# EasyEDA Pro project 智能视觉调参板.eprj

# Schematic 原理图
Create Date: 2023-11-29; Page Name: P1; Project Name: 智能视觉调参板; Schematic Name: Schematic1; Update Date: 2023-11-29; Company: 嘉立创EDA; Page Size: A4; Version: V1.0
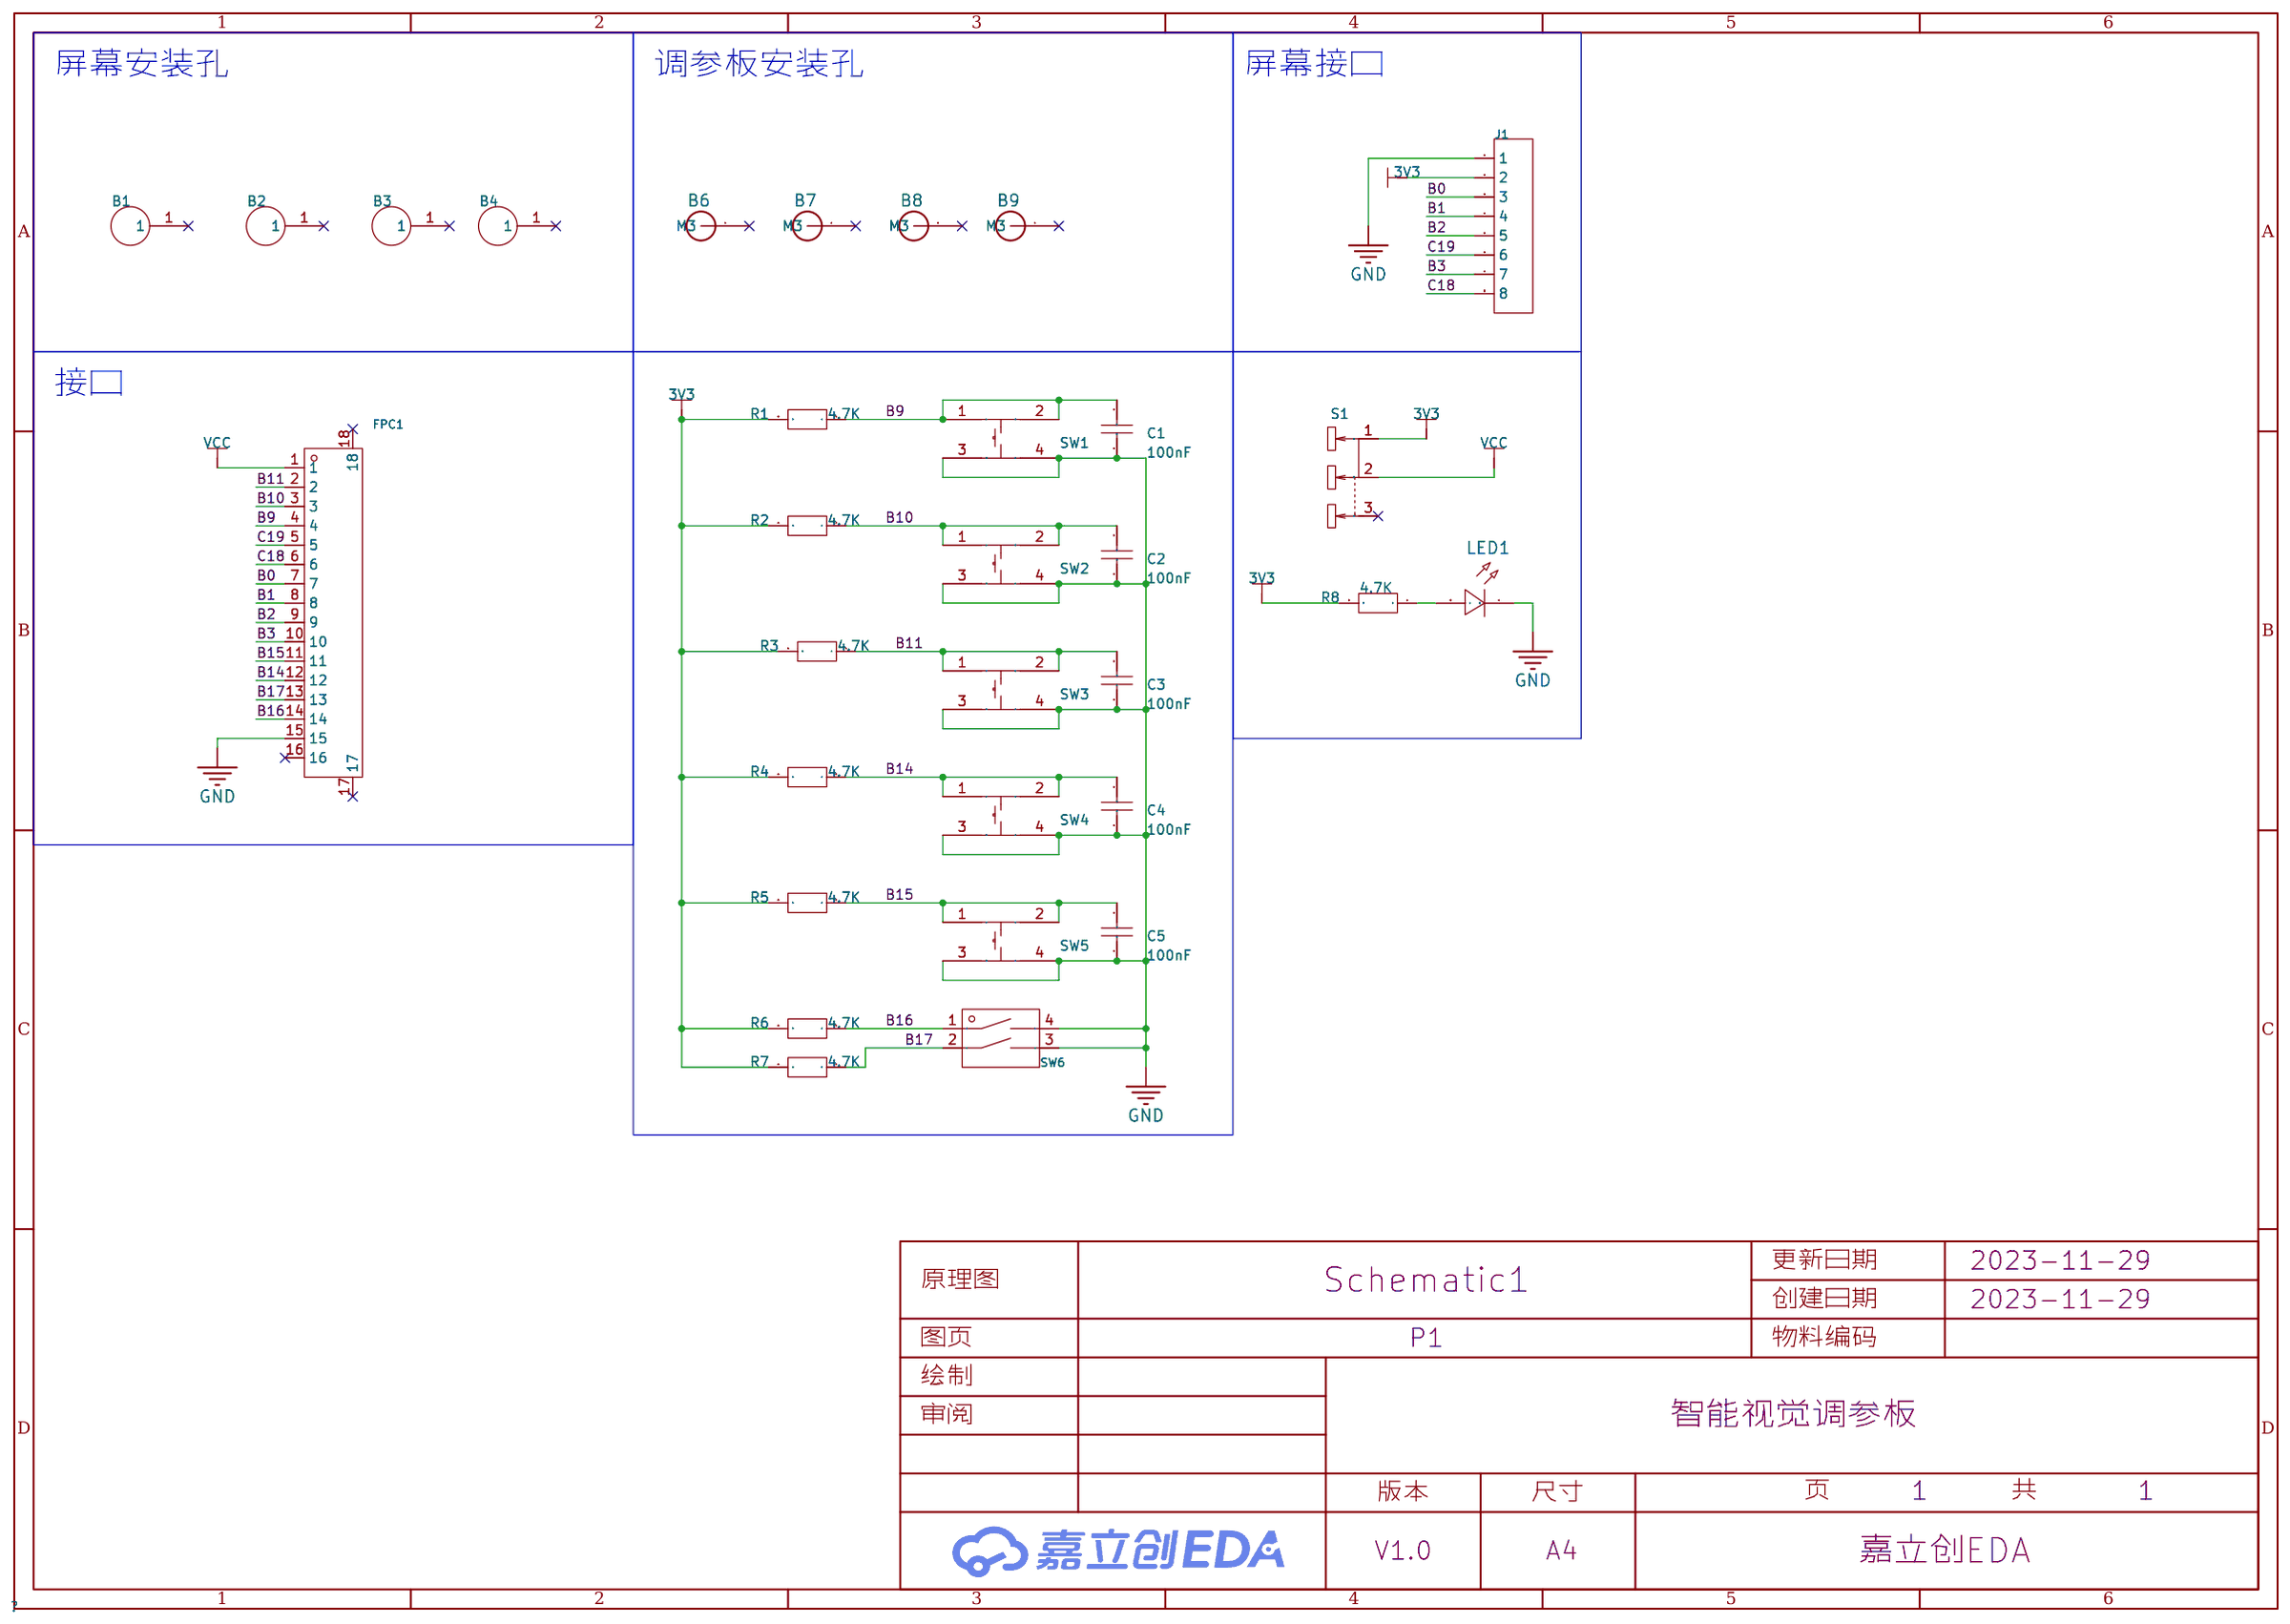
[diagram p0: schematic sheet]

## Parts
B1  -  [M2]
B2  -  [M2]
B3  -  [M2]
B4  -  [M2]
B6  M3螺柱孔_JX  [M3]
B7  M3螺柱孔_JX  [M3]
B8  M3螺柱孔_JX  [M3]
B9  M3螺柱孔_JX  [M3]
C1  100nF  [C0603]
C2  100nF  [C0603]
C3  100nF  [C0603]
C4  100nF  [C0603]
C5  100nF  [C0603]
FPC1  FPC-05F-16PH20  [FPC-SMD_16P-P0.50_FPC-05F-16PH20]
J1  -  [HDR-TH_8P-P2.54-V-F-1]
LED1  -  [LED_0603]
R1  4.7K  [R0603]
R2  4.7K  [R0603]
R3  4.7K  [R0603]
R4  4.7K  [R0603]
R5  4.7K  [R0603]
R6  4.7K  [R0603]
R7  4.7K  [R0603]
R8  4.7K  [R0603]
S1  SS-12D10L3  [SW-TH_SS-12D10L3]
SW1  TS-1002S-05026C  [KEY-SMD_4P-L6.0-W6.0-P4.50-LS9.0]
SW2  TS-1002S-05026C  [KEY-SMD_4P-L6.0-W6.0-P4.50-LS9.0]
SW3  TS-1002S-05026C  [KEY-SMD_4P-L6.0-W6.0-P4.50-LS9.0]
SW4  TS-1002S-05026C  [KEY-SMD_4P-L6.0-W6.0-P4.50-LS9.0]
SW5  TS-1002S-05026C  [KEY-SMD_4P-L6.0-W6.0-P4.50-LS9.0]
SW6  KF1001-02P-R0-FL-ON-01B  [SW-TH_KF1001-02P-R0-FL-ON-01B]

## Library data of the parts
B1-B4 = M2
B6-B9 = M3螺柱孔_JX
C1-C5 = 0603B104K500NT: 容值:100nF;精度:±10%;额定电压:50V;材质(温度系数):X7R;; LCSC Part Name: 100nF ±10% 50V; Supplier Part: C30926; Manufacturer: FH(风华); Supplier Footprint: 0603; JLCPCB Part Class: Extended Part; Datasheet: https://atta.szlcsc.com/upload/public/pdf/source/20200305/C486355_26A10D38EF8C2A5C37091D0039909270.pdf; Supplier: LCSC; Tolerance: ±10%; Voltage Rated: 50V; Temperature Coefficient: X7R
FPC1 = FPC-05F-16PH20: 间距:0.5mm;触点数量:16P;锁定特性:翻盖式;安装类型:卧贴;触点类型:下接;工作温度范围:-25℃~+85℃;; LCSC Part Name: 0.5mm P数:16P 翻盖式 下接; Supplier Part: C2856801; Manufacturer: XUNPU(讯普); Supplier Footprint: SMD,P=0.5mm; JLCPCB Part Class: Extended Part; Datasheet: https://atta.szlcsc.com/upload/public/pdf/source/20210922/C2856801_73A554E58C5577257FCEC843978D3BA6.pdf; Supplier: LCSC; Pitch: 0.5mm; Number of Contacts: 16P; Locking Feature: 翻盖式; Mounting Type: 卧贴; Contact Type: 下接; Height Above Board: 2mm; FFC, FCB Thickness: 0.3mm; Operating Temperature Range: -25℃~+85℃
J1 = HDR-F_2.54_1x8P: Supplier Part: C27438; Supplier Footprint: 插件
LED1 = LED_0603-R: Supplier Footprint: 0603
R1-R8 = 0603: Supplier Part: C9900021181; JLCPCB Part Class: 扩展库; Datasheet: https://atta.szlcsc.comnull; Supplier: LCSC
S1 = SS-12D10L3: 额定电流(DC):3A;额定电压(DC):125V;额定电流(AC):3A;额定电压(AC):125V;电路结构:单刀双掷;安装方式:直插;机械寿命:1万次;开关颜色:黑色;; LCSC Part Name: 柄长3mm 直插双档 滑动开关 大电流; Supplier Part: C319013; Manufacturer: XKB Connectivity(中国星坤); Supplier Footprint: 插件; JLCPCB Part Class: 扩展库; Datasheet: https://atta.szlcsc.com/upload/public/pdf/source/20211009/D6412F37AABE6F9459A6EE7FA4DAEADB.pdf; Supplier: LCSC; Current Rating (DC): 3A; Voltage Rating (DC): 125V; Current Rating (AC): 3A; Voltage Rating (AC): 125V; Circuit: 单刀双掷; Mounting Style: 直插; Mechanical Life: 1万次; Actuator Color: 黑色; Actuator Style: 矩形柱状; Pin Style: PC引脚; Operating Temperature: -40℃~+85℃; Switch Length: 13mm; Switch Width: 6.8mm; Switch Height: 6.4mm
SW1-SW5 = TS-1002S-05026C: 电路结构:单刀单掷;触点电流:50mA;额定电压(DC):12V;安装方式:立贴;带灯:-;机械寿命:-;; LCSC Part Name: 6*6*5mm 立贴 轻触开关; Supplier Part: C455110; Manufacturer: XUNPU(讯普); Supplier Footprint: SMD,6x6mm; JLCPCB Part Class: 扩展库; Datasheet: https://atta.szlcsc.com/upload/public/pdf/source/20191118/C455126_F61E8FA1ED640FB1CE0B30B55DEB62E3.pdf; Supplier: LCSC; Circuit: 单刀单掷; Actuator Style: 圆形按钮; Switch Length: 6mm; Switch Width: 6mm; Switch Height: 5mm; Contact Current: 50mA; Voltage Rating (DC): 12V; Mounting Style: 立贴
SW6 = KF1001-02P-R0-FL-ON-01B: 拨码开关 平拨，凸起式 单刀单掷  2  2.54mm; LCSC Part Name: 间距2.54mm 平拨,凸起式 2位拨码开关; Supplier Part: C976324; Manufacturer: 凯峰; Supplier Footprint: 插件; JLCPCB Part Class: Extended Part; Datasheet: https://atta.szlcsc.com/upload/public/pdf/source/20201229/C976324_7B1CB18A800AB7399198E0C73F3ACFC5.pdf; Supplier: LCSC

## Nets
3V3: J1.2 R1.2 R2.2 R3.2 R4.2 R5.2 R6.2 R7.2 R8.2 S1.1
GND: C1.1 C2.1 C3.1 C4.1 C5.1 FPC1.15 J1.1 LED1.1(C) SW1.3 SW1.4 SW2.3 SW2.4 SW3.3 SW3.4 SW4.3 SW4.4 SW5.3 SW5.4 SW6.3 SW6.4
VCC: FPC1.1 S1.2
B0: FPC1.7 J1.3
B1: FPC1.8 J1.4
B2: FPC1.9 J1.5
B3: FPC1.10 J1.7
B9: C1.2 FPC1.4 R1.1 SW1.1 SW1.2
B10: C2.2 FPC1.3 R2.1 SW2.1 SW2.2
B11: C3.2 FPC1.2 R3.1 SW3.1 SW3.2
B14: C4.2 FPC1.12 R4.1 SW4.1 SW4.2
B15: C5.2 FPC1.11 R5.1 SW5.1 SW5.2
B16: FPC1.14 R6.1 SW6.1
B17: FPC1.13 R7.1 SW6.2
C18: FPC1.6 J1.8
C19: FPC1.5 J1.6
Net-(LED1-2): LED1.2(A) R8.1

Not connected (* = marked no-connect by the designer): B1 1*; B2 1*; B3 1*; B4 1*; B6 1(M3)*; B7 1(M3)*; B8 1(M3)*; B9 1(M3)*; FPC1 16* 17* 18*; S1 3*

## Notes on the sheet
- 屏幕安装孔
- 调参板安装孔
- 屏幕接口
- 接口

# Board 调参板_V1
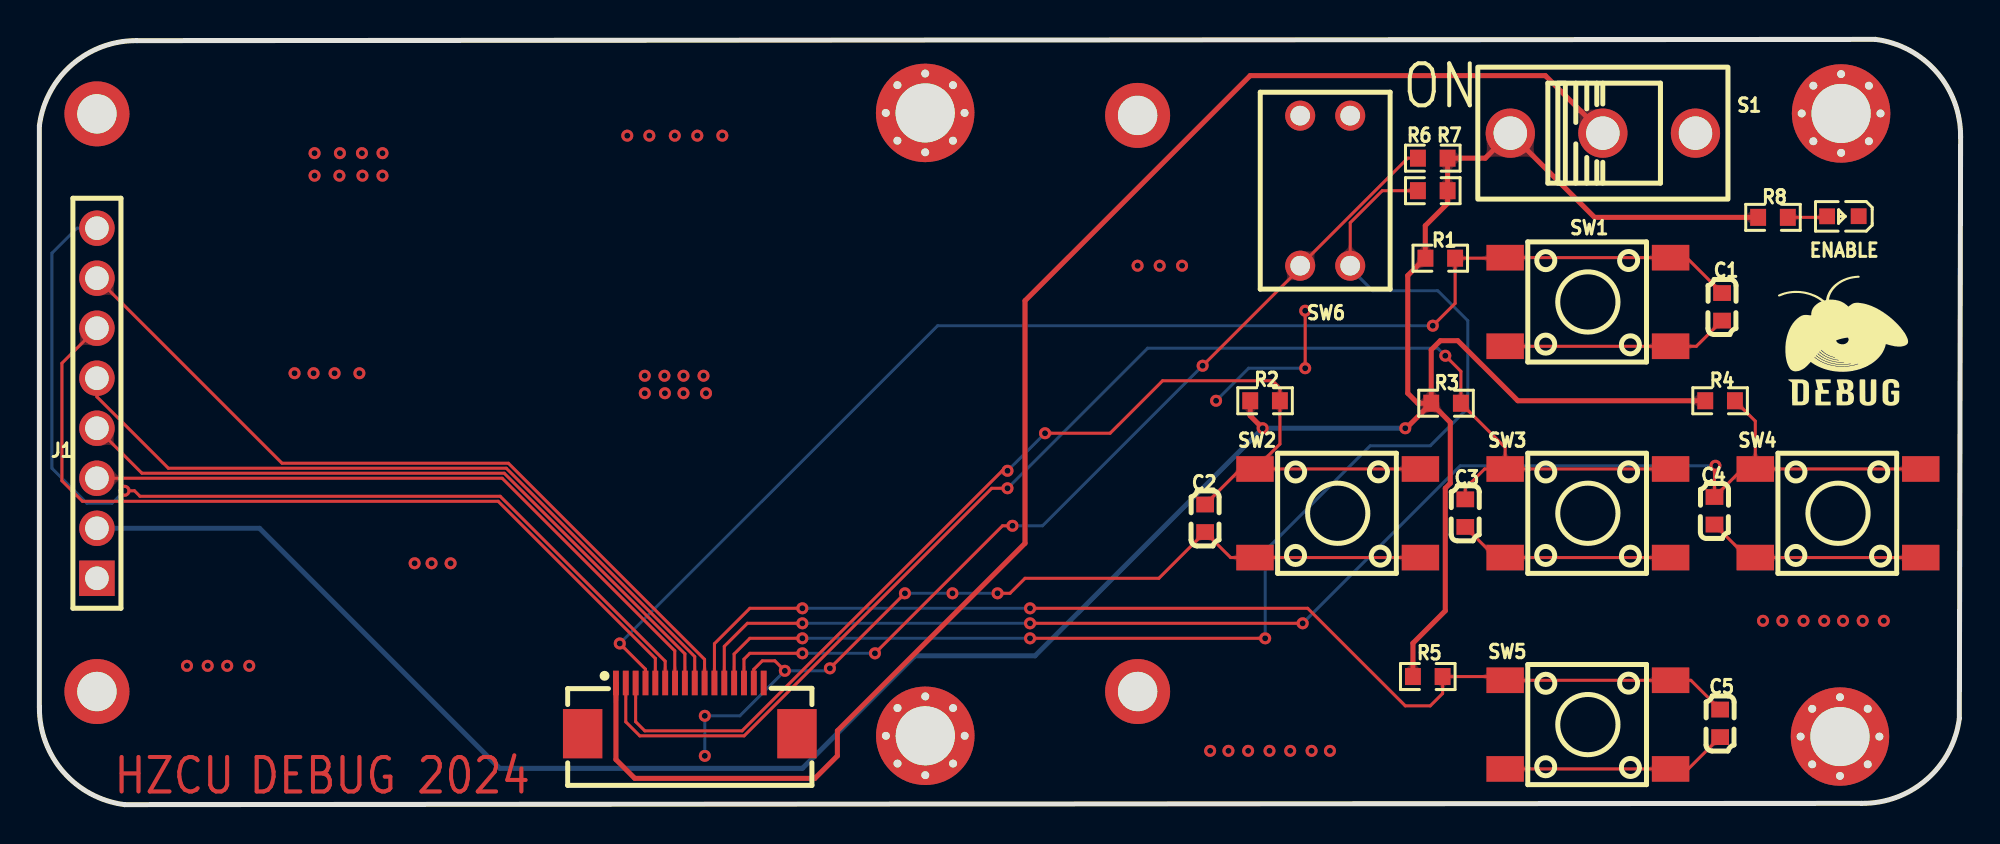
[diagram p1: board, top side]
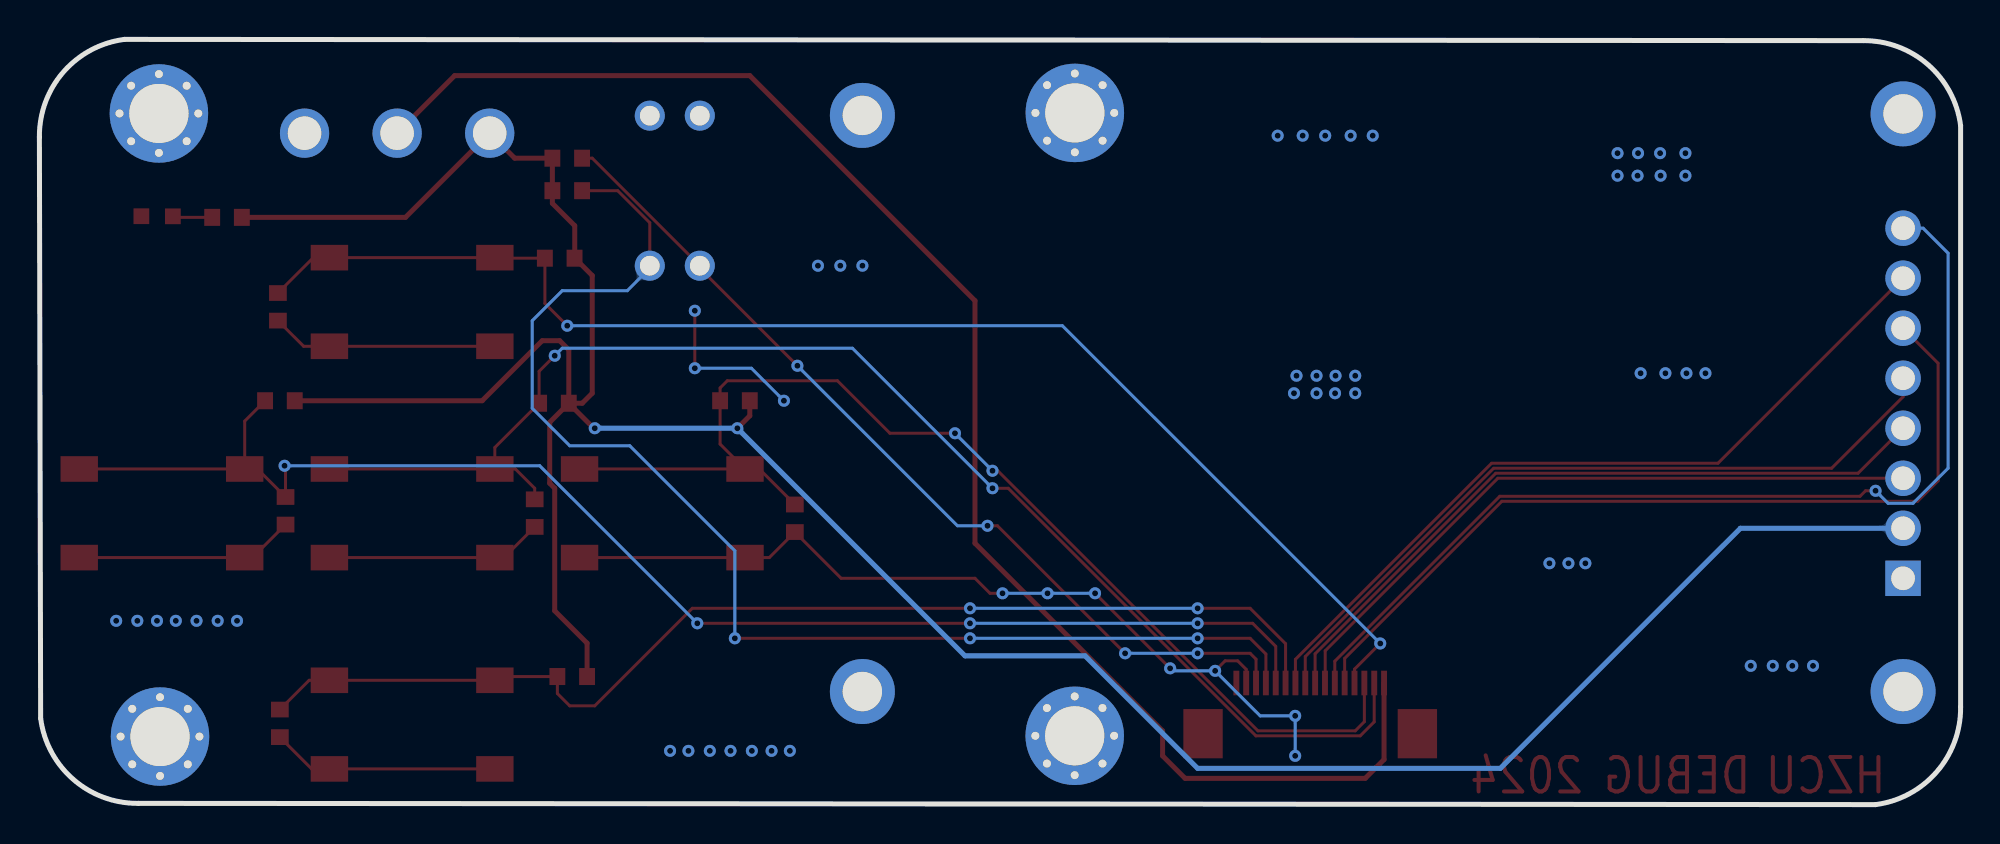
[diagram p2: board, bottom side, seen from below]

Outline 97.54 x 38.86 mm; copper layers: Top Layer, Bottom Layer. Coordinates in mm from the lower left corner of the outline.
Outline path: 0,34.48 0,4.95 arc(1.22,1.66) 4.32,0 92.52,0.06 arc(95.82,1.28) 97.47,4.38 97.54,33.91 arc(96.32,37.21) 93.22,38.86 4.95,38.8 arc(1.66,37.58) 0,34.48
Stack: Top Layer 0.035mm / Dielectric1 1.51mm FR4 er 4.5 / Bottom Layer 0.035mm

## Design rules (mm)
template: JLCPCB Capability(Two Layers Board)
spacing copperThickness1oz (default): track to track 0.102, other pairs 0.152 to 0.3
spacing copperThickness2oz: track to track 0.203, other pairs 0.152 to 0.3
track width copperThickness1oz (default): min 0.127, default 0.254, max 2.54
track width copperThickness2oz: min 0.203, default 0.254, max 2.54
differential pair differentialPair (default): width min 0.127, default 0.254, max 2.54; gap min 0.152, default 0.152
via viaSize (default): diameter min 0.5, default 0.61, max 10; hole min 0.3, default 0.305, max 6.3

## Placement (name value [footprint] x y rotation side)
B1  -  [M2]  55.76 35 0 top
B2  -  [M2]  2.92 5.74 0 top
B3  -  [M2]  2.92 35.08 0 top
B4  -  [M2]  55.76 5.74 0 top
B6  M3螺柱孔_JX  [M3]  91.41 3.46 0 top
B7  M3螺柱孔_JX  [M3]  44.98 3.5 0 top
B8  M3螺柱孔_JX  [M3]  91.47 35.1 0 top
B9  M3螺柱孔_JX  [M3]  44.97 35.13 0 top
C1  100nF  [C0603]  85.43 25.28 90 top
C2  100nF  [C0603]  59.18 14.54 90 top
C3  100nF  [C0603]  72.39 14.8 90 top
C4  100nF  [C0603]  85.04 14.92 90 top
C5  100nF  [C0603]  85.33 4.13 90 top
ENABLE  -  [LED_0603]  91.51 29.87 180 top
FPC1  FPC-05F-16PH20  [FPC-SMD_16P-P0.50_FPC-05F-16PH20]  33.02 4.89 0 top
J1  -  [HDR-TH_8P-P2.54-V-F-1]  2.92 20.38 90 top
R1  4.7K  [R0603]  71.12 27.75 180 top
R2  4.7K  [R0603]  62.22 20.51 180 top
R3  4.7K  [R0603]  71.41 20.38 180 top
R4  4.7K  [R0603]  85.33 20.51 180 top
R5  4.7K  [R0603]  70.48 6.5 180 top
R6  4.7K  [R0603]  70.74 32.83 0 top
R7  4.7K  [R0603]  70.74 31.18 0 top
R8  4.7K  [R0603]  88.01 29.82 180 top
S1  SS-12D10L3  [SW-TH_SS-12D10L3]  79.38 34.1 0 top
SW1  TS-1002S-05026C  [KEY-SMD_4P-L6.0-W6.0-P4.50-LS9.0]  78.61 25.53 0 top
SW2  TS-1002S-05026C  [KEY-SMD_4P-L6.0-W6.0-P4.50-LS9.0]  65.91 14.8 0 top
SW3  TS-1002S-05026C  [KEY-SMD_4P-L6.0-W6.0-P4.50-LS9.0]  78.61 14.8 0 top
SW4  TS-1002S-05026C  [KEY-SMD_4P-L6.0-W6.0-P4.50-LS9.0]  91.31 14.8 0 top
SW5  TS-1002S-05026C  [KEY-SMD_4P-L6.0-W6.0-P4.50-LS9.0]  78.61 4.06 0 top
SW6  KF1001-02P-R0-FL-ON-01B  [SW-TH_KF1001-02P-R0-FL-ON-01B]  65.28 31.18 0 top

## Footprints (pads in the part's own frame, mm; a bottom-side part is the same pattern mirrored in y, then rotated)
C0603
  rect 0.8x0.9 smd: 1(-0.7,0) 2(0.7,0)
FPC-SMD_16P-P0.50_FPC-05F-16PH20
  rect 0.3x1.25 smd: 1(-3.75,1.288) 2(-3.25,1.288) 3(-2.75,1.288) 4(-2.25,1.288) 5(-1.75,1.288) 6(-1.25,1.288) 7(-0.75,1.288) 8(-0.25,1.288) 9(0.25,1.288) 10(0.75,1.288) 11(1.25,1.288) 12(1.75,1.288) 13(2.25,1.288) 14(2.75,1.288) 15(3.25,1.288) 16(3.75,1.288)
  rect 2x2.5 smd: 17(5.44,-1.288) 18(-5.44,-1.288)
HDR-TH_8P-P2.54-V-F-1
  rect 1.8x1.8 hole 1.2: 1(-8.89,0)
  round 1.8 hole 1.2: 2(-6.35,0) 3(-3.81,0) 4(-1.27,0) 5(1.27,0) 6(3.81,0) 7(6.35,0) 8(8.89,0)
KEY-SMD_4P-L6.0-W6.0-P4.50-LS9.0
  rect 1.9x1.3 smd: 1(-4.2,2.25) 2(4.2,2.25) 3(-4.2,-2.25) 4(4.2,-2.25)
LED_0603
  rect 0.8x0.8 smd: 1(-0.851,-0.01) 2(0.75,-0.005)
M2
  round 3.3 hole 2: 1(0,0)
M3
  round 0.6 hole 0.405x0.4: 1(-2,0) 1(-1.41,1.409) 1(-1.41,-1.41) 1(0,2) 1(0,-2) 1(1.41,1.409) 1(1.41,-1.41) 1(2,0)
  round 5 hole 3.005x3: 1(0,0)
R0603
  rect 0.806x0.864 smd: 1(-0.753,0) 2(0.753,0)
SW-TH_KF1001-02P-R0-FL-ON-01B
  round 1.524 hole 1: 1(-1.27,-3.81) 2(1.27,-3.81) 3(1.27,3.81) 4(-1.27,3.81)
SW-TH_SS-12D10L3
  round 2.5 hole 1.7: 1(-4.7,0) 2(0,0) 3(4.7,0)

## Nets
As in the schematic, except:
GND: C1.1 C2.1 C3.1 C4.1 C5.1 ENABLE.1 FPC1.15 J1.1 SW1.3 SW1.4 SW2.3 SW2.4 SW3.3 SW3.4 SW4.3 SW4.4 SW5.3 SW5.4 SW6.3 SW6.4
$1N2501: ENABLE.2 R8.1

Pads without a net: B1 1; B2 1; B3 1; B4 1; B6 1; B7 1; B8 1; B9 1; FPC1 16 17 18; S1 3

## Via types
v1: diameter 0.61, hole 0.305, Top Layer to Bottom Layer, 81 vias

## Routing (per net, layer and track width the routed paths; a pad name or vN(x,y) marks a point on that pad's centre or on a via; arc(x,y) is an arc through that point)
3V3: length 147.5
  Top Layer w0.254: R5.2 69.73,8.2 71.37,9.84 71.37,16.07 71.63,16.32 71.63,19.42 R3.2 ; R3.2 70.66,23.1 71.12,23.56 72.01,23.56 75.06,20.51 R4.2 ; R3.2 69.39,19.11 v1(69.34,19.11) ; R3.2 69.98,20.38 69.47,20.89 69.47,26.87 70.36,27.76 ; 70.36,27.76 70.36,29.4 71.49,30.54 R7.2 R6.2 73.41,32.83 S1.1 78.95,29.82 R8.2 ; 70.36,27.76 R1.2 ; v1(62.1,19.11) 61.47,19.75 R2.2
  Bottom Layer w0.254: J1.2 11.18,14.03 23.37,1.84 38.73,1.84 44.45,7.56 50.55,7.56 v1(62.1,19.11) v1(69.34,19.11)
GND: length 98.9
  Top Layer w0.152: SW4.4 SW4.3 86.72,12.55 C4.1 ; SW3.4 73.95,12.55 C3.1 ; v1(37.85,6.79) 37.34,7.3 36.7,7.3 36.27,6.87 FPC1.15 ; 74.41,23.28 SW1.4 84.12,23.28 C1.1 ; v1(64.26,22.16) v1(64.26,25.08) ; 74.41,1.81 SW5.4 83.71,1.81 C5.1 ; SW2.4 SW2.3 60.48,12.55 C2.1 56.83,11.49 50.04,11.49 49.28,10.73 v1(48.64,10.73) ; v1(43.94,10.73) v1(40.13,6.92)
  Bottom Layer w0.152: v1(40.13,6.92) 40.01,6.79 v1(37.85,6.79) 35.56,4.51 v1(33.78,4.51) v1(33.78,2.48) ; v1(64.26,22.16) 61.39,22.16 v1(59.74,20.51) ; v1(48.64,10.73) v1(46.36,10.73) v1(43.94,10.73)
  vias: v1(7.49,7.05) v1(8.54,7.05) v1(9.54,7.05) v1(10.65,7.05) v1(12.95,21.91) v1(13.97,33.08) v1(13.97,31.94) v1(13.92,21.91) v1(14.99,21.91) v1(15.26,33.08) v1(15.23,31.94) v1(16.25,21.91) v1(16.38,33.08) v1(16.4,31.94) v1(17.42,33.08) v1(17.42,31.94) v1(19.05,12.26) v1(19.91,12.26) v1(20.88,12.26) v1(29.84,33.97) v1(30.73,21.78) v1(30.73,20.89) v1(30.97,33.97) v1(31.73,21.78) v1(31.76,20.89) v1(32.26,33.97) v1(32.7,21.78) v1(32.7,20.89) v1(33.4,33.97) v1(33.72,21.78) v1(33.84,20.89) v1(34.67,33.97) v1(55.75,27.37) v1(56.88,27.37) v1(58.01,27.37) v1(59.44,2.73) v1(60.37,2.73) v1(61.37,2.73) v1(62.45,2.73) v1(63.5,2.73) v1(64.59,2.73) v1(65.52,2.73) v1(87.5,9.33) v1(88.49,9.33) v1(89.56,9.33) v1(90.61,9.33) v1(91.57,9.33) v1(92.57,9.33) v1(93.64,9.33)
VCC: length 78.3
  Top Layer w0.254: S1.2 76.45,37.02 61.47,37.02 50.04,25.59 50.04,13.27 40.51,3.75 40.51,2.48 39.37,1.33 30.23,1.33 29.27,2.29 FPC1.1
B0: length 34.6
  Top Layer w0.152: FPC1.7 32.26,6.19 32.26,7.81 23.5,16.57 J1.3
B1: length 36.1
  Top Layer w0.152: FPC1.8 32.77,7.66 23.6,16.83 5.21,16.83 J1.4
B2: length 38.1
  Top Layer w0.152: FPC1.9 33.27,7.52 23.71,17.08 6.55,17.08 2.92,20.71 J1.5
B3: length 40.1
  Top Layer w0.152: J1.7 12.32,17.34 23.81,17.34 33.77,7.38 FPC1.10
B9: length 68.7
  Top Layer w0.152: FPC1.4 30.77,6.88 v1(29.46,8.18) 29.46,8.19 ; v1(70.74,24.32) 71.87,25.45 R1.1 74.39,27.75 74.41,27.78 SW1.2 83.63,27.78 C1.2
  Bottom Layer w0.152: v1(70.74,24.32) 45.6,24.32 v1(29.46,8.18)
B10: length 58.7
  Top Layer w0.152: SW2.1 60.99,17.05 C2.2 ; SW2.1 62.98,18.31 R2.1 62.98,21.16 62.61,21.53 57.02,21.53 54.36,18.86 v1(51.05,18.86) ; SW2.1 SW2.2 ; FPC1.3 30.27,4.21 30.73,3.75 35.67,3.75 48.88,16.95 v1(49.15,16.95)
  Bottom Layer w0.152: v1(49.15,16.95) v1(51.05,18.86)
B11: length 70.6
  Top Layer w0.152: FPC1.2 29.77,4.2 30.48,3.49 35.78,3.49 48.35,16.07 v1(49.15,16.07) ; 74.41,17.05 SW3.2 ; 74.41,17.05 73.37,17.05 72.39,16.07 72.39,15.5 ; 74.41,17.05 74.41,18.14 R3.1 72.17,22 v1(71.37,22.8)
  Bottom Layer w0.152: v1(49.15,16.07) 56.26,23.18 70.99,23.18 v1(71.37,22.8)
B14: length 72.5
  Top Layer w0.152: SW4.1 86.46,17.05 C4.2 85.04,17.16 v1(85.09,17.21) ; SW4.1 87.11,19.48 R4.1 ; SW4.1 SW4.2 ; v1(50.29,9.21) v1(64.14,9.21) ; FPC1.12 34.77,8.04 35.94,9.21 v1(38.73,9.21)
  Bottom Layer w0.152: v1(38.73,9.21) v1(50.29,9.21) ; v1(64.14,9.21) 72.14,17.21 v1(85.09,17.21)
B15: length 57.7
  Top Layer w0.152: C5.2 83.84,6.31 SW5.2 74.41,6.31 74.22,6.5 R5.1 71.24,5.64 70.61,5.02 69.34,5.02 64.39,9.97 v1(50.29,9.97) ; v1(38.73,9.97) 36.07,9.97 34.27,8.17 FPC1.11
  Bottom Layer w0.152: v1(50.29,9.97) v1(38.73,9.97)
B16: length 46
  Top Layer w0.152: FPC1.14 35.77,7.39 36.07,7.68 v1(38.73,7.68) ; v1(49.4,14.16) 48.89,14.16 v1(42.42,7.68) ; v1(59.05,22.29) 64.01,27.24 SW6.1 69.47,32.83 R6.1
  Bottom Layer w0.152: v1(59.05,22.29) 50.93,14.16 v1(49.4,14.16) ; v1(38.73,7.68) v1(42.42,7.68)
B17: length 64.4
  Top Layer w0.152: R7.1 68.18,31.18 66.55,29.55 SW6.2 ; v1(38.73,8.45) 36.07,8.45 35.27,7.65 FPC1.13 ; v1(50.29,8.45) v1(62.23,8.45)
  Bottom Layer w0.152: v1(50.29,8.45) v1(38.73,8.45) ; v1(62.23,8.45) 62.23,12.89 67.56,18.22 70.61,18.22 72.52,20.13 72.52,24.57 70.99,26.1 67.69,26.1 66.55,27.24 SW6.2
C18: length 50.6
  Top Layer w0.152: FPC1.6 31.77,7.28 23.39,15.66 5.11,15.66 4.83,15.94 v1(4.32,15.94)
  Bottom Layer w0.152: v1(4.32,15.94) 3.68,15.3 2.41,15.3 0.64,17.08 0.64,28 1.91,29.27 J1.8
C19: length 43.6
  Top Layer w0.152: FPC1.5 31.27,7.42 23.29,15.41 2.18,15.41 1.14,16.45 1.14,22.42 J1.6
$1N2501: length 2
  Top Layer w0.152: ENABLE.2 90.71,29.82 R8.1

## Copper pours and planes (outline as drawn; the poured copper is in the pictures)
GND on Top Layer: -8.13,48.96 103.76,48.96 103.89,49.09 103.89,-10.1 -8,-10.1 -8.13,-9.97
GND on Bottom Layer: -8.76,48.7 103,48.7 103.12,48.83 103.12,-10.35 -8.64,-10.35 -8.76,-10.48

Small or netless copper shapes (teardrops, artwork), in the pictures only: 123 on Top Layer, 38 on Bottom Layer

## Text on the board
Top Layer: HZCU | DEBUG | 2024
Top Silkscreen Layer: ON
